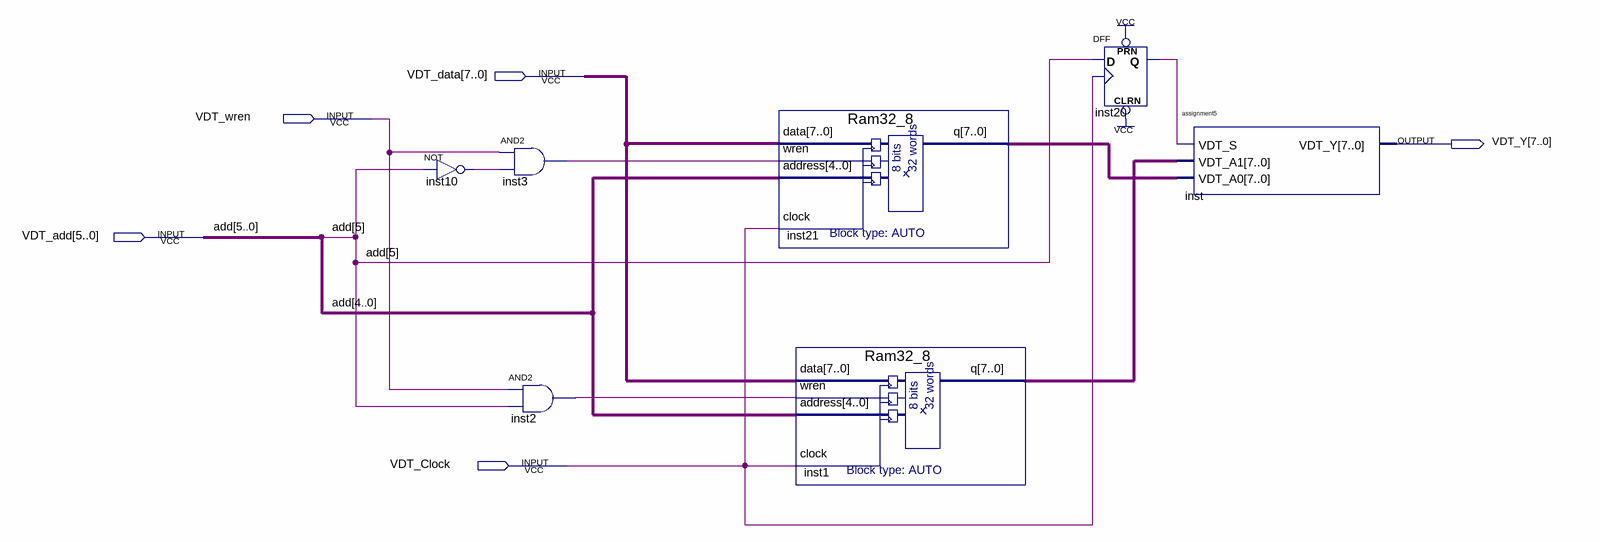
[diagram p0: schematic sheet]
// Quartus schematic assignment11.bdf as structural Verilog: 7 symbols, 5 pins
module assignment11 (
  input  [7:0] VDT_data,
  input  VDT_wren,
  input  [5:0] VDT_add,
  input  VDT_Clock,
  output [7:0] VDT_Y
);

  wire inst2_out, inst3_out, inst10_out, inst20_q;
  wire [7:0] inst1_q, inst21_q;

  not inst10 (inst10_out, VDT_add[5]);
  and inst3 (inst3_out, VDT_wren, inst10_out);
  and inst2 (inst2_out, VDT_wren, VDT_add[5]);
  Ram32_8 inst21 (.data(VDT_data), .wren(inst3_out), .address(VDT_add[4:0]), .clock(VDT_Clock), .q(inst21_q));
  Ram32_8 inst1 (.data(VDT_data), .wren(inst2_out), .address(VDT_add[4:0]), .clock(VDT_Clock), .q(inst1_q));
  DFF inst20 (.CLRN(1'b1), .CLK(VDT_Clock), .D(VDT_add[5]), .PRN(1'b1), .Q(inst20_q));
  assignment5 inst (.VDT_S(inst20_q), .VDT_A1(inst1_q), .VDT_A0(inst21_q), .VDT_Y(VDT_Y));

  // Other names for the same wires on the sheet: add[5:0] = VDT_add
endmodule
